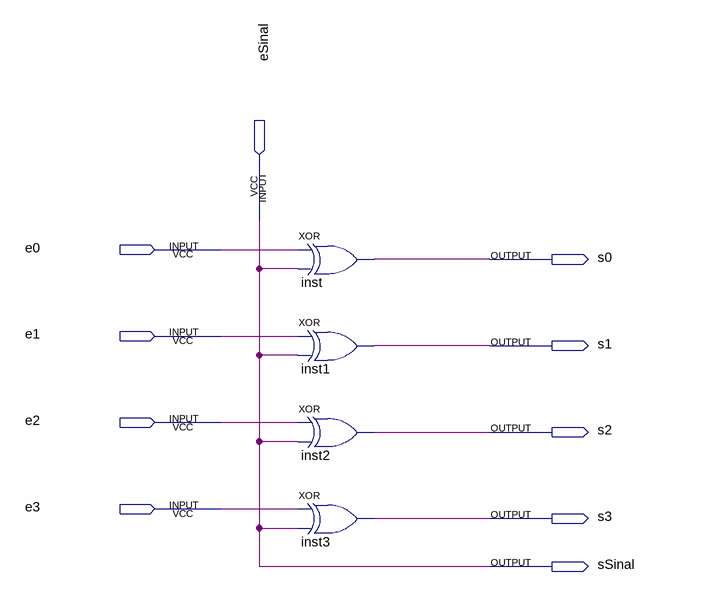
[diagram p0: schematic sheet]
// Quartus schematic comp1.bdf as structural Verilog: 4 symbols, 10 pins
module comp1 (
  input  eSinal,
  input  e0,
  input  e1,
  input  e2,
  input  e3,
  output s0,
  output s1,
  output s2,
  output s3,
  output sSinal
);

  xor inst (s0, e0, eSinal);
  xor inst1 (s1, e1, eSinal);
  xor inst2 (s2, e2, eSinal);
  xor inst3 (s3, e3, eSinal);

  assign sSinal = eSinal;
endmodule
